# EAGLE design D25-connector (EAGLE 5.06)
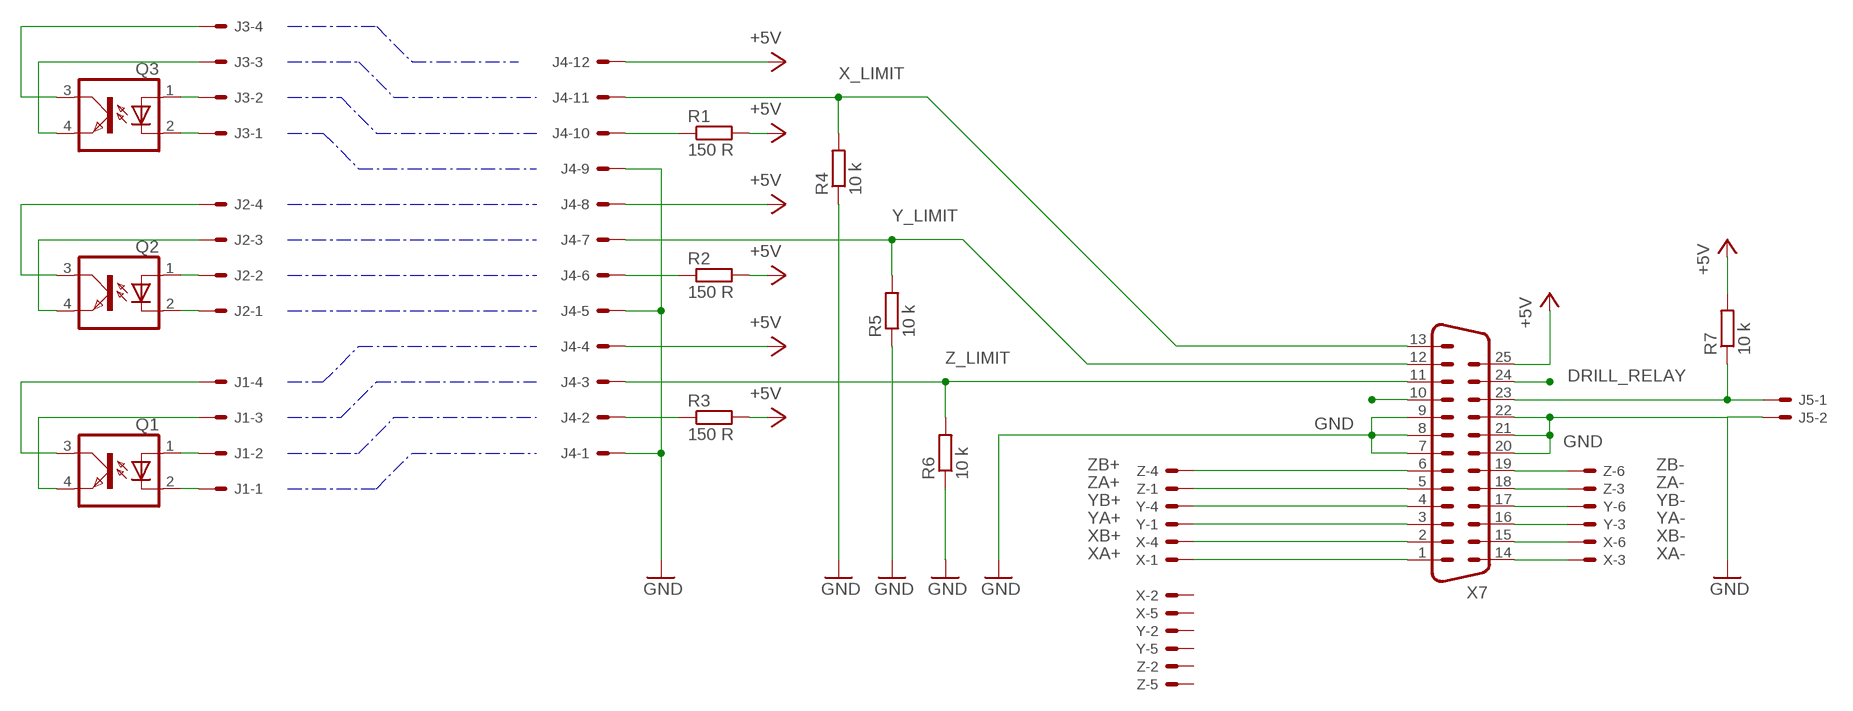
[diagram p0: schematic, sheet 1]

## Parts
J1  22-27-2041-04  [6410-04]
J2  22-27-2041-04  [6410-04]
J3  22-27-2041-04  [6410-04]
J4  22-27-2121-12  [6410-12]
J5  22-27-2021-02  [6410-02]
Q1  SFH9302  [SFH9302]
Q2  SFH9302  [SFH9302]
Q3  SFH9302  [SFH9302]
R1  150 R  R-EU_0207/10  [0207/10]
R2  150 R  R-EU_0207/10  [0207/10]
R3  150 R  R-EU_0207/10  [0207/10]
R4  10 k  R-EU_0207/10  [0207/10]
R5  10 k  R-EU_0207/10  [0207/10]
R6  10 k  R-EU_0207/10  [0207/10]
R7  10 k  R-EU_0207/10  [0207/10]
X  22-27-2061-06  [6410-06]
X7  M25HP  [M25HP]
Y  22-27-2061-06  [6410-06]
Z  22-27-2061-06  [6410-06]

## Nets
+5V: J4.4 J4.8 J4.12 R1.2 R2.2 R3.2 R7.2 X7.25
DRILL_RELAY: X7.24
GND: J4.1 J4.5 J4.9 J5.2 R4.1 R5.1 R6.1 X7.7 X7.8 X7.9 X7.20 X7.21 X7.22
KILLSWITCH: J5.1 R7.1 X7.23
N$1: J1.2 Q1.1(A)
N$2: J1.1 Q1.2(C)
N$3: J1.4 Q1.3(COL)
N$4: J1.3 Q1.4(EMIT)
N$5: J2.2 Q2.1(A)
N$6: J2.1 Q2.2(C)
N$7: J2.4 Q2.3(COL)
N$8: J2.3 Q2.4(EMIT)
N$9: J3.2 Q3.1(A)
N$10: J3.1 Q3.2(C)
N$11: J3.4 Q3.3(COL)
N$12: J3.3 Q3.4(EMIT)
N$29: J4.10 R1.1
N$30: J4.6 R2.1
N$31: J4.2 R3.1
N$32: X7.10
X_LIMIT: J4.11 R4.2 X7.13
XA+: X7.1 X.1
XA-: X7.14 X.3
XB+: X7.2 X.4
XB-: X7.15 X.6
Y_LIMIT: J4.7 R5.2 X7.12
YA+: X7.3 Y.1
YA-: X7.16 Y.3
YB+: X7.4 Y.4
YB-: X7.17 Y.6
Z_LIMIT: J4.3 R6.2 X7.11
ZA+: X7.5 Z.1
ZA-: X7.18 Z.3
ZB+: X7.6 Z.4
ZB-: X7.19 Z.6
Unconnected: X.2 X.5 Y.2 Y.5 Z.2 Z.5

## Buses
B$1
B$2
B$3
B$4
B$5
B$6
B$7
B$8
B$9
B$10
B$11
B$12

## Library data of the parts
J1-J3 = con-molex:22-?-04: CONNECTOR wire to board 2.54 mm (.1 inch) pitch header
J4 = con-molex:22-?-12: CONNECTOR wire to board 2.54 mm (.1 inch) pitch header
J5 = con-molex:22-?-02: CONNECTOR wire to board 2.54 mm (.1 inch) pitch header
Q1-Q3 = optocoupler:SFH9*: Slotted Interrupter / Gabellichtschranke Source: http://www.osram.convergy.de/
R1-R7 = resistor:R-EU_: RESISTOR, European symbol
X Y Z = con-molex:22-?-06: CONNECTOR wire to board 2.54 mm (.1 inch) pitch header
X7 = con-subd:M25: SUB-D

## Board
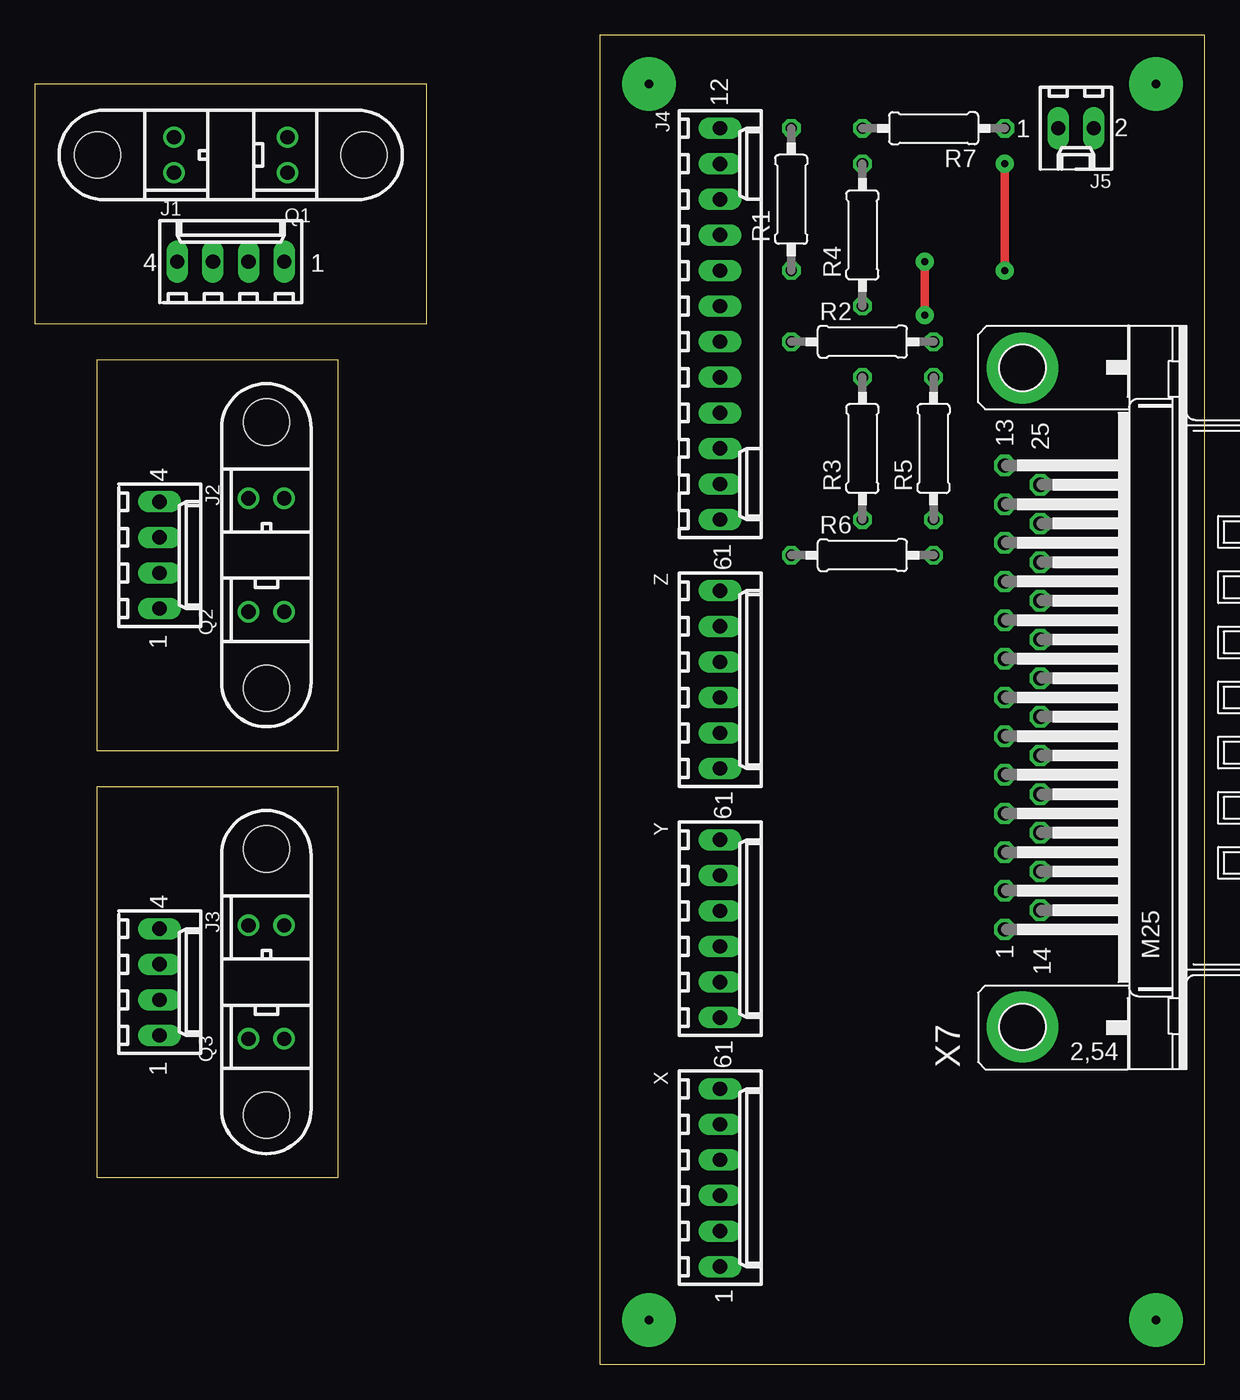
[diagram p1: board, top side]
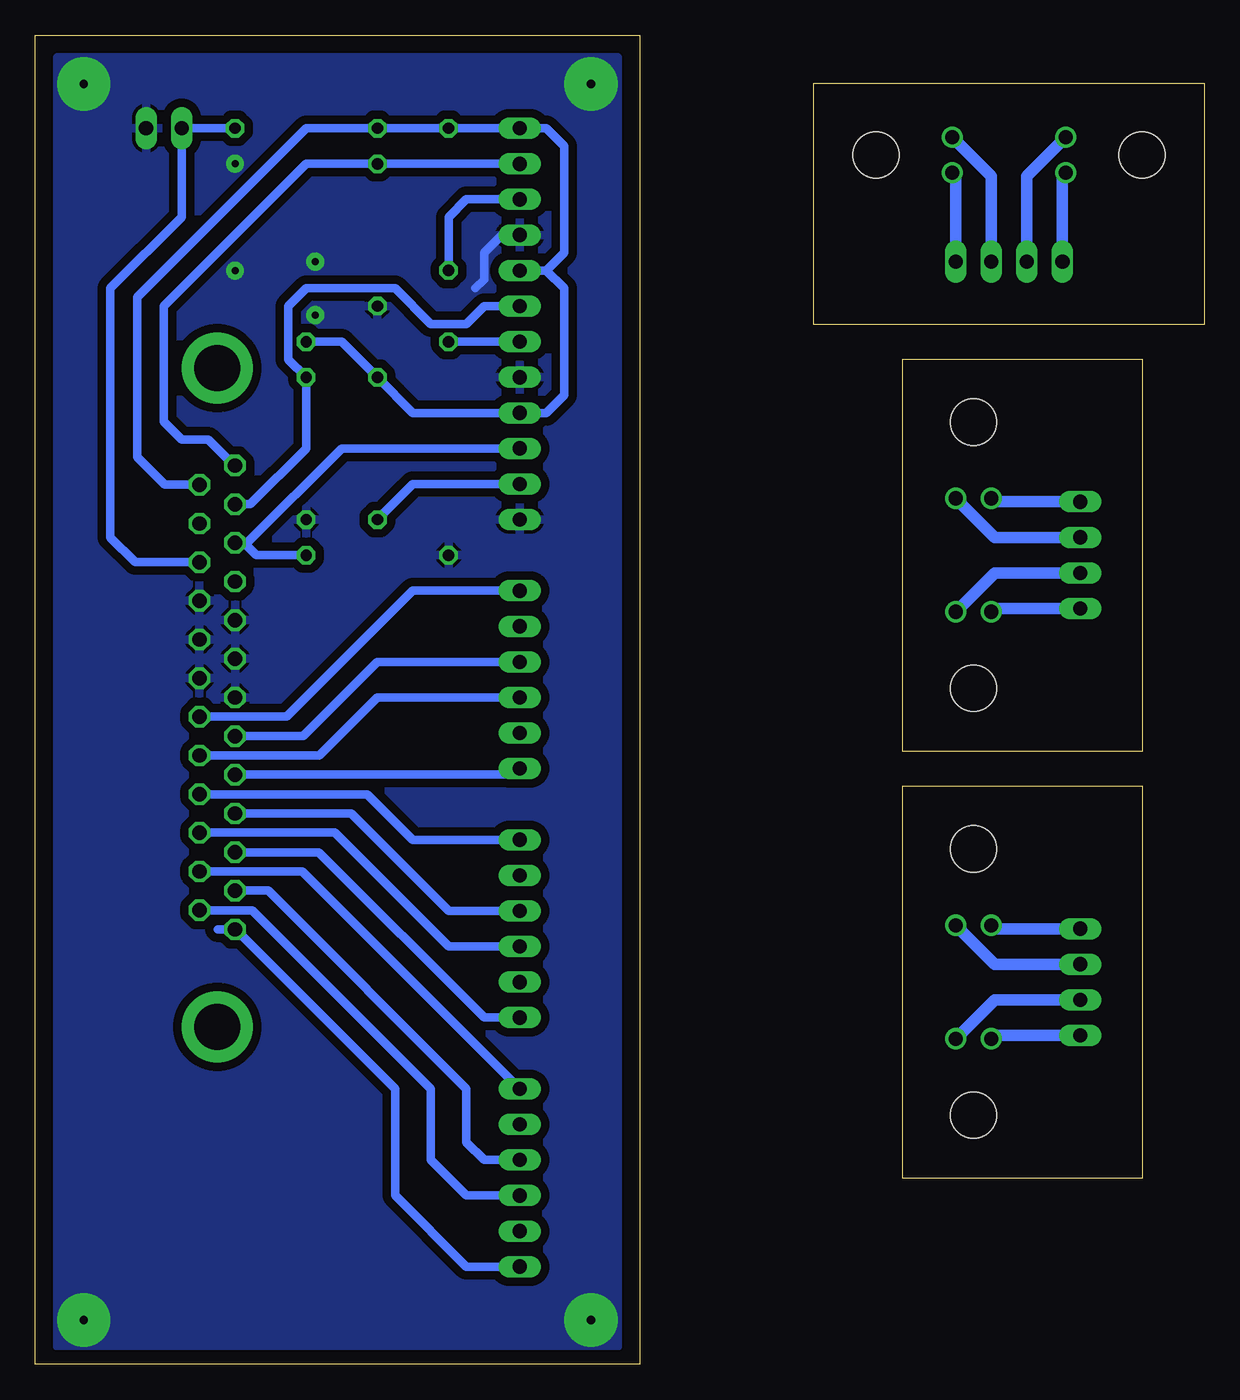
[diagram p2: board, bottom side, seen from below]

Size 83.49 x 94.92 mm. Coordinates in mm from the lower left corner, seen from the top.
Outline: 40.32,0 83.49,0 83.49,94.92 40.32,94.92 40.32,0
Outline: 0,74.3 0,91.44 27.94,91.44 27.94,74.3 0,74.3
Outline: 4.45,71.75 21.59,71.75 21.59,43.81 4.45,43.81 4.45,71.75
Outline: 4.45,41.27 21.59,41.27 21.59,13.34 4.45,13.34 4.45,41.27
Copper layers (1*16): Top 0.035mm / dielectric 1.5mm / Bottom 0.035mm
Design rules "default": minimum track width 10mil, minimum drill 24mil, track to track 8mil, track to pad 8mil, pad to pad 8mil, via to via 8mil, smd to smd 8mil, copper to edge 40mil, drill to drill 8mil, minimum pad ring 10mil, minimum via ring 8mil, stop-mask expansion 4mil, vias tented up to drill 0mil, thermal gap 10mil

### Footprints (pad centres in the part's own frame; a part is rotated, then mirrored left to right if it is on the bottom)
6410-04 = drill 1.016 long: 1 3.81,0; 2 1.27,0; 3 -1.27,0; 4 -3.81,0
6410-12 = drill 1.016 long: 1 13.97,0; 2 11.43,0; 3 8.89,0; 4 6.35,0; 5 3.81,0; 6 1.27,0; 7 -1.27,0; 8 -3.81,0; 9 -6.35,0; 10 -8.89,0; 11 -11.43,0; 12 -13.97,0
6410-02 = drill 1.016 long: 1 1.27,0; 2 -1.27,0
SFH9302 = drill 1.016 round: 1 -4.05,-1.27; 2 -4.05,1.27; 3 4.05,1.27; 4 4.05,-1.27 | hole 3.3: -9.5,0; 9.5,0
0207/10 = drill 0.813 octagon: 1 -5.08,0; 2 5.08,0
6410-06 = drill 1.016 long: 1 6.35,0; 2 3.81,0; 3 1.27,0; 4 -1.27,0; 5 -3.81,0; 6 -6.35,0
M25HP = drill 1.016 octagon: 1 -16.561,1.27; 2 -13.792,1.27; 3 -11.049,1.27; 4 -8.28,1.27; 5 -5.512,1.27; 6 -2.769,1.27; 7 0,1.27; 8 2.769,1.27; 9 5.512,1.27; 10 8.28,1.27; 11 11.049,1.27; 12 13.792,1.27; 13 16.561,1.27; 14 -15.189,-1.27; 15 -12.421,-1.27; 16 -9.652,-1.27; 17 -6.909,-1.27; 18 -4.14,-1.27; 19 -1.372,-1.27; 20 1.372,-1.27; 21 4.14,-1.27; 22 6.909,-1.27; 23 9.652,-1.27; 24 12.421,-1.27; 25 15.189,-1.27 | drill 3.302 pad 5.08 round: G1 -23.52,0; G2 23.52,0

### Placement (x,y rotation side)
J1  13.97,78.74 0 top
J2  8.89,57.78 270 top
J3  8.89,27.3 270 top
J4  48.89,74.3 270 top
J5  74.3,88.27 180 top
Q1  13.97,86.36 180 top
Q2  16.51,57.78 90 top
Q3  16.51,27.3 90 top
R1  53.97,83.19 90 top
R2  59.05,73.03 0 top
R3  59.05,65.41 90 top
R4  59.05,80.64 90 top
R5  64.14,65.41 90 top
R6  59.05,57.78 0 top
R7  64.14,88.27 180 top
X  48.89,13.34 270 top
X7  70.48,47.62 90 top
Y  48.89,31.11 270 top
Z  48.89,48.89 270 top

### Tracks (layer width: path | path; a pad name or v marks a point on that pad's centre or on a via)
+5V
  Bottom 0.61: 46.99,78.11 45.72,79.38 45.72,87 46.99,88.27 J4.12 R1.2 R7.2 64.14,88.27 76.2,76.2 76.2,64.77 74.24,62.81 X7.25 | 46.99,78.11 J4.8 | 46.99,78.11 45.72,76.83 45.72,69.22 46.99,67.95 J4.4 56.51,67.95 R3.2 61.59,73.03 R2.2
GND  (via drill 0.5 pad 1.27, 0.6 pad 3.81)
  Top 0.61: v63.5,74.93 v63.5,78.74 | v69.22,78.11 v69.22,85.72
  Bottom 0.61: J4.9 50.16,80.64 51.43,79.38 51.43,77.47 52.07,76.83
  other vias: 43.81,91.44 80.01,91.44 43.81,3.18 80.01,3.18
  pour Bottom (isolate 0.61): 41.91,93.34 81.92,93.34 81.92,1.27 41.91,1.27
KILLSWITCH
  Bottom 0.61: X7.23 76.33,57.28 78.11,59.05 78.11,76.83 73.03,81.92 J5.1 R7.1
N$1
  Bottom 0.813: J1.2 15.24,84.85 Q1.1
N$2
  Bottom 0.813: J1.1 17.78,84.85 Q1.2
N$3
  Bottom 0.813: J1.4 10.16,84.85 Q1.3
N$4
  Bottom 0.813: J1.3 12.7,84.85 Q1.4
N$5
  Bottom 0.813: J2.2 15,56.52 Q2.1
N$6
  Bottom 0.813: J2.1 15,53.98 Q2.2
N$7
  Bottom 0.813: J2.4 15,61.59 Q2.3
N$8
  Bottom 0.813: J2.3 15,59.05 Q2.4
N$9
  Bottom 0.813: J3.2 15,26.04 Q3.1
N$10
  Bottom 0.813: J3.1 15,23.5 Q3.2
N$11
  Bottom 0.813: J3.4 15,31.11 Q3.3
N$12
  Bottom 0.813: J3.3 15,28.57 Q3.4
N$29
  Bottom 0.61: J4.10 52.7,83.19 53.97,81.92 R1.1
N$30
  Bottom 0.61: J4.6 R2.1
N$31
  Bottom 0.61: J4.2 56.51,62.87 R3.1
X_LIMIT
  Bottom 0.61: J4.11 R4.2 64.14,85.72 74.3,75.56 74.3,67.31 73.03,66.04 71.12,66.04 69.27,64.19 X7.13
XA+
  Bottom 0.61: 70.43,31.06 X7.1 69.16,31.06 57.78,19.68 57.78,12.07 52.7,6.99 X.1
XA-
  Bottom 0.61: X7.14 68,32.44 55.24,19.68 55.24,14.61 52.7,12.07 X.3
XB+
  Bottom 0.61: X7.2 66.85,33.83 52.7,19.68 52.7,15.88 51.43,14.61 X.4
XB-
  Bottom 0.61: X7.15 64.41,35.2 X.6
Y_LIMIT
  Bottom 0.61: X7.12 68.12,61.42 64.14,65.41 R5.2 65.41,71.75 65.41,75.56 64.14,76.83 57.78,76.83 55.24,74.3 52.7,74.3 51.43,75.56 J4.7
YA+
  Bottom 0.61: X7.3 63.25,36.58 51.43,24.77 Y.1
YA-
  Bottom 0.61: X7.16 62.1,37.97 53.97,29.84 Y.3
YB+
  Bottom 0.61: X7.4 60.93,39.34 53.97,32.38 Y.4
YB-
  Bottom 0.61: X7.17 59.77,40.72 56.51,37.47 Y.6
Z_LIMIT
  Bottom 0.61: J4.3 61.59,65.41 68.33,58.67 68.58,58.67 | 68.58,58.67 X7.11 | R6.2 67.69,57.78 68.58,58.67
ZA+
  Bottom 0.61: X7.5 49.33,42.11 Z.1
ZA-
  Bottom 0.61: X7.18 63.2,43.48 59.05,47.62 Z.3
ZB+
  Bottom 0.61: X7.6 64.36,44.86 59.05,50.16 Z.4
ZB-
  Bottom 0.61: X7.19 65.51,46.25 56.51,55.24 Z.6